# Altium schematic sheet Controller.SchDoc: Controller schematic
size A4; Date: 2018-02-12; CheckedBy: Mr. Pauwels; Author: Robbie Smedts; CompanyName: Thomas More; DrawnBy: Robbie Smedts; Engineer: Robbie Smedts & Vincent Agemans; Organization: KULeuven; DocumentNumber: 2; Revision: 2; SheetNumber: 2; SheetTotal: 5; DocumentName: Controller Schematic; ProjectName: Stepper driver
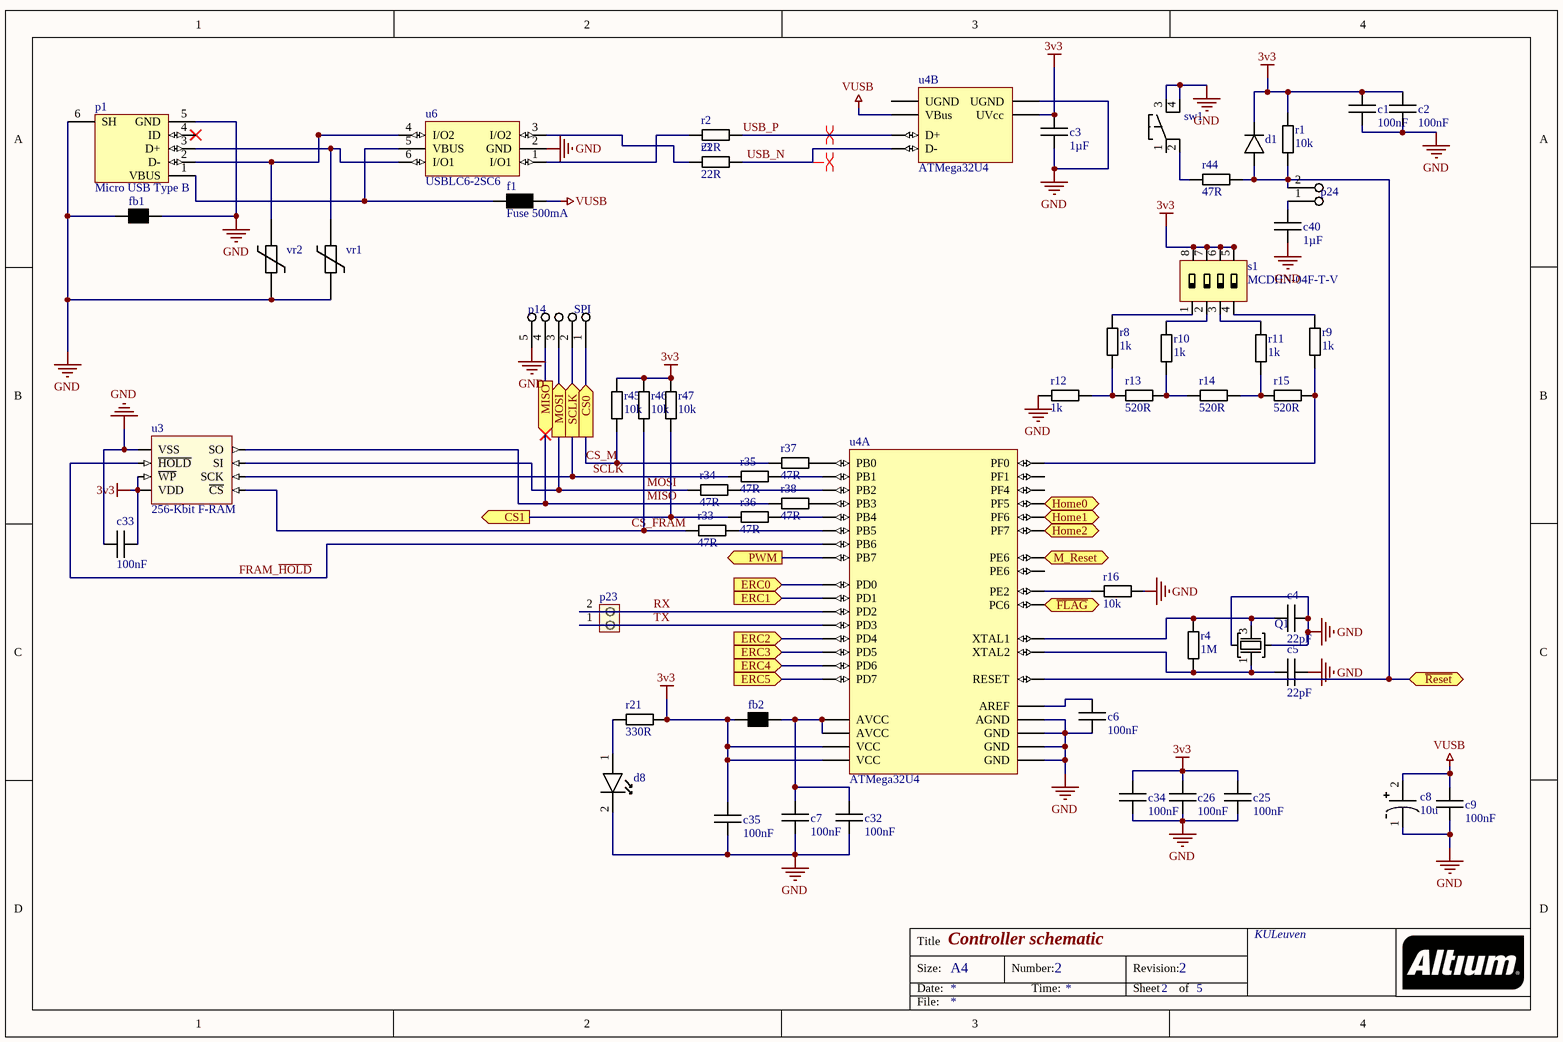
[diagram p0: Controller.SchDoc]

## Parts
c1  100nF  [0603]
c2  100nF  [0603]
c3  1µF  [0603]
c4  22pF  [0603]
c5  22pF  [0603]
c6  100nF  [0603]
c7  100nF  [0603]
c8  10u  [Elco-C]
c9  100nF  [0603]
c25  100nF  [0603]
c26  100nF  [0603]
c32  100nF  [0603]
c33  100nF  [0603]
c34  100nF  [0603]
c35  100nF  [0603]
c40  1µF  [0603]
d1  CD1206-S01575  [1206 - DIODE]  (value not drawn)
d8  Green SMD LED  [0603 - LED]  (value not drawn)
f1  Fuse 500mA  [PTC Fuses]
fb1  0603 Ferrite Bead  [0603]  (value not drawn)
fb2  0603 Ferrite Bead  [0603]  (value not drawn)
p1  Micro USB Type B  [Micro USB Type B]
p14  SPI  [1x5-HeaderPin]
p23  Wire-to-Board 2P  [WtB-F-2p]  (value not drawn)
p24  2 Pin Header  [1x2-HeaderPin]  (value not drawn)
Q1  Crystal 16MHz, 3.2x2.5mm  [X32]  (value not drawn)
r1  10k  [0603]
r2  22R  [0603]
r3  22R  [0603]
r4  1M  [0603]
r8  1k  [0603]
r9  1k  [0603]
r10  1k  [0603]
r11  1k  [0603]
r12  1k  [0603]
r13  520R  [0603]
r14  520R  [0603]
r15  520R  [0603]
r16  10k  [0603]
r21  330R  [0603]
r33  47R  [0603]
r34  47R  [0603]
r35  47R  [0603]
r36  47R  [0603]
r37  47R  [0603]
r38  47R  [0603]
r44  47R  [0603]
r45  10k  [0603]
r46  10k  [0603]
r47  10k  [0603]
s1  MCDHN-04F-T-V  [Dipswitch-4]
sw1  MCDTSJW-6  [MCDTSJW6]  (value not drawn)
u3  256-Kbit F-RAM  [SOIC8N]
u4  ATMega32U4  [TQFP-44]  (parts A,B of 2)
u6  USBLC6-2SC6  [SOT23-6]
vr1  CG0603MLC-05E  [0603]  (value not drawn)
vr2  CG0603MLC-05E  [0603]  (value not drawn)

## Ports
CS0 (out), CS1 (out), ERC0 (in), ERC1 (in), ERC2 (in), ERC3 (in), ERC4 (in), ERC5 (in), Home0 (in), Home1 (in), Home2 (in), M_Reset (out), MISO (in), MOSI (out), PWM (out), SCLK (out), ~{FLAG} (in), ~{Reset} (bidir)

## Nets
3v3: c1.1 c2.1 c3.1 c25.1 c26.1 c33.2 c34.1 c35.1 d1.1(Kathode) fb2.1 r1.2 r21.2 r45.2 r46.2 r47.2 s1.5 s1.6 s1.7 s1.8 u3.3(~{WP}) u3.8(VDD) u4.2(UVcc) u4.14(VCC) u4.34(VCC)
GND: c1.2 c2.2 c3.2 c4.2 c5.2 c6.1 c7.2 c8.1 c9.2 c25.2 c26.2 c32.2 c33.1 c34.2 c35.2 c40.1 d8.2(Kathode) fb1.1 fb1.2 p1.5(GND) p1.6(SH) p14.5 Q1.2 Q1.4 r12.2 r16.1 sw1.3 sw1.4 u3.4(VSS) u4.5(UGND) u4.15(GND) u4.23(GND) u4.35(GND) u4.43(AGND) u6.2(GND) vr1.1 vr2.1
VUSB: c8.2 c9.1 f1.2 u4.7(VBus)
CS1: r36.1 r47.1 ; port CS1
CS_FRAM: r33.1 r46.1 u3.1(~{CS})
CS_M: p14.1 r37.1 r45.1 ; port CS0
ERC0: u4.18(PD0) ; port ERC0
ERC1: u4.19(PD1) ; port ERC1
ERC2: u4.25(PD4) ; port ERC2
ERC3: u4.22(PD5) ; port ERC3
ERC4: u4.26(PD6) ; port ERC4
ERC5: u4.27(PD7) ; port ERC5
~{FLAG}: u4.31(PC6) ; port ~{FLAG}
FRAM_~{HOLD}: u3.7(~{HOLD}) u4.30(PB6)
Home0: u4.38(PF5) ; port Home0
Home1: u4.37(PF6) ; port Home1
Home2: u4.36(PF7) ; port Home2
M_Reset: u4.1(PE6) ; port M_Reset
MISO: p14.4 r38.1 u3.2(SO) ; port MISO
MOSI: p14.3 r34.1 u3.5(SI) ; port MOSI
PWM: u4.12(PB7) ; port PWM
~{Reset}: d1.2(Anode) p24.2 r1.1 r44.2 u4.13(RESET) ; port ~{Reset}
RX: p23.2 u4.20(PD2)
SCLK: p14.2 r35.1 u3.6(SCK) ; port SCLK
TX: p23.1 u4.21(PD3)
USB_N: r3.2 u4.3(D-)
USB_P: r2.2 u4.4(D+)
Netc4_1: c4.1 Q1.3 r4.1 u4.17(XTAL1)
Netc5_1: c5.1 Q1.1 r4.2 u4.16(XTAL2)
Netc6_2: c6.2 u4.42(AREF)
Netc7_1: c7.1 c32.1 fb2.2 u4.24(AVCC) u4.44(AVCC)
Netc40_2: c40.2 p24.1
Netd8_1: d8.1(Anode) r21.1
Netf1_1: f1.1 p1.1(VBUS) u6.5(VBUS)
Netp1_2: p1.2(D-) u6.4(I/O2) vr2.2
Netp1_3: p1.3(D+) u6.6(I/O1) vr1.2
Netr2_1: r2.1 u6.1(I/O1)
Netr3_1: r3.1 u6.3(I/O2)
Netr8_1: r8.1 r12.1 r13.2
Netr8_2: r8.2 s1.1
Netr9_1: r9.1 r15.1 u4.41(PF0)
Netr9_2: r9.2 s1.4
Netr10_1: r10.1 r13.1 r14.2
Netr10_2: r10.2 s1.2
Netr11_1: r11.1 r14.1 r15.2
Netr11_2: r11.2 s1.3
Netr16_2: r16.2 u4.33(PE2)
Netr33_2: r33.2 u4.29(PB5)
Netr34_2: r34.2 u4.10(PB2)
Netr35_2: r35.2 u4.9(PB1)
Netr36_2: r36.2 u4.28(PB4)
Netr37_2: r37.2 u4.8(PB0)
Netr38_2: r38.2 u4.11(PB3)
Netr44_1: r44.1 sw1.2

Not connected (* = marked no-connect by the designer): p1 4(ID)*; sw1 1; u4 39(PF4) 40(PF1)

## Layout directives
differential pair: USB_N, USB_P

## Notes on the sheet
- Title
- Size:
- Date:
- A4
- Number:
- Time:
- Revision:
- Sheet
- of
- File:

## Library data of the parts
c1-c7 c9 c25 c26 c32-c35 c40 = 0603 Capacitor: ...F
c8 = Elco C
d1 = CD1206-S01575: Switching Chip Diode
d8 = Green SMD LED: 0603 Package
f1 = MF-MSMF Fuse: Style 1
p1 = Micro USB Type B: SMD
p14 = 5 Pin Header
Q1 = Crystal 16MHz, 3.2x2.5mm: X32
r1-r4 r8-r16 r21 r33-r38 r44-r47 = 0603 Resistor: ...R
s1 = MCDHN-04F-T-V: Dipswitch 4 way
sw1 = MCDTSJW-6: Push button
u3 = FM25W256: 256-Kbit (32Kx8) Serial SPI F-RAM
u6 = USBLC6-2SC6: SOT23-6 ESD
vr1 vr2 = CG0603MLC-05E: 5V, 8V Varistor - 0603